# EAGLE board ngff-cardem (EAGLE 7.7.0)
VERSION: v2
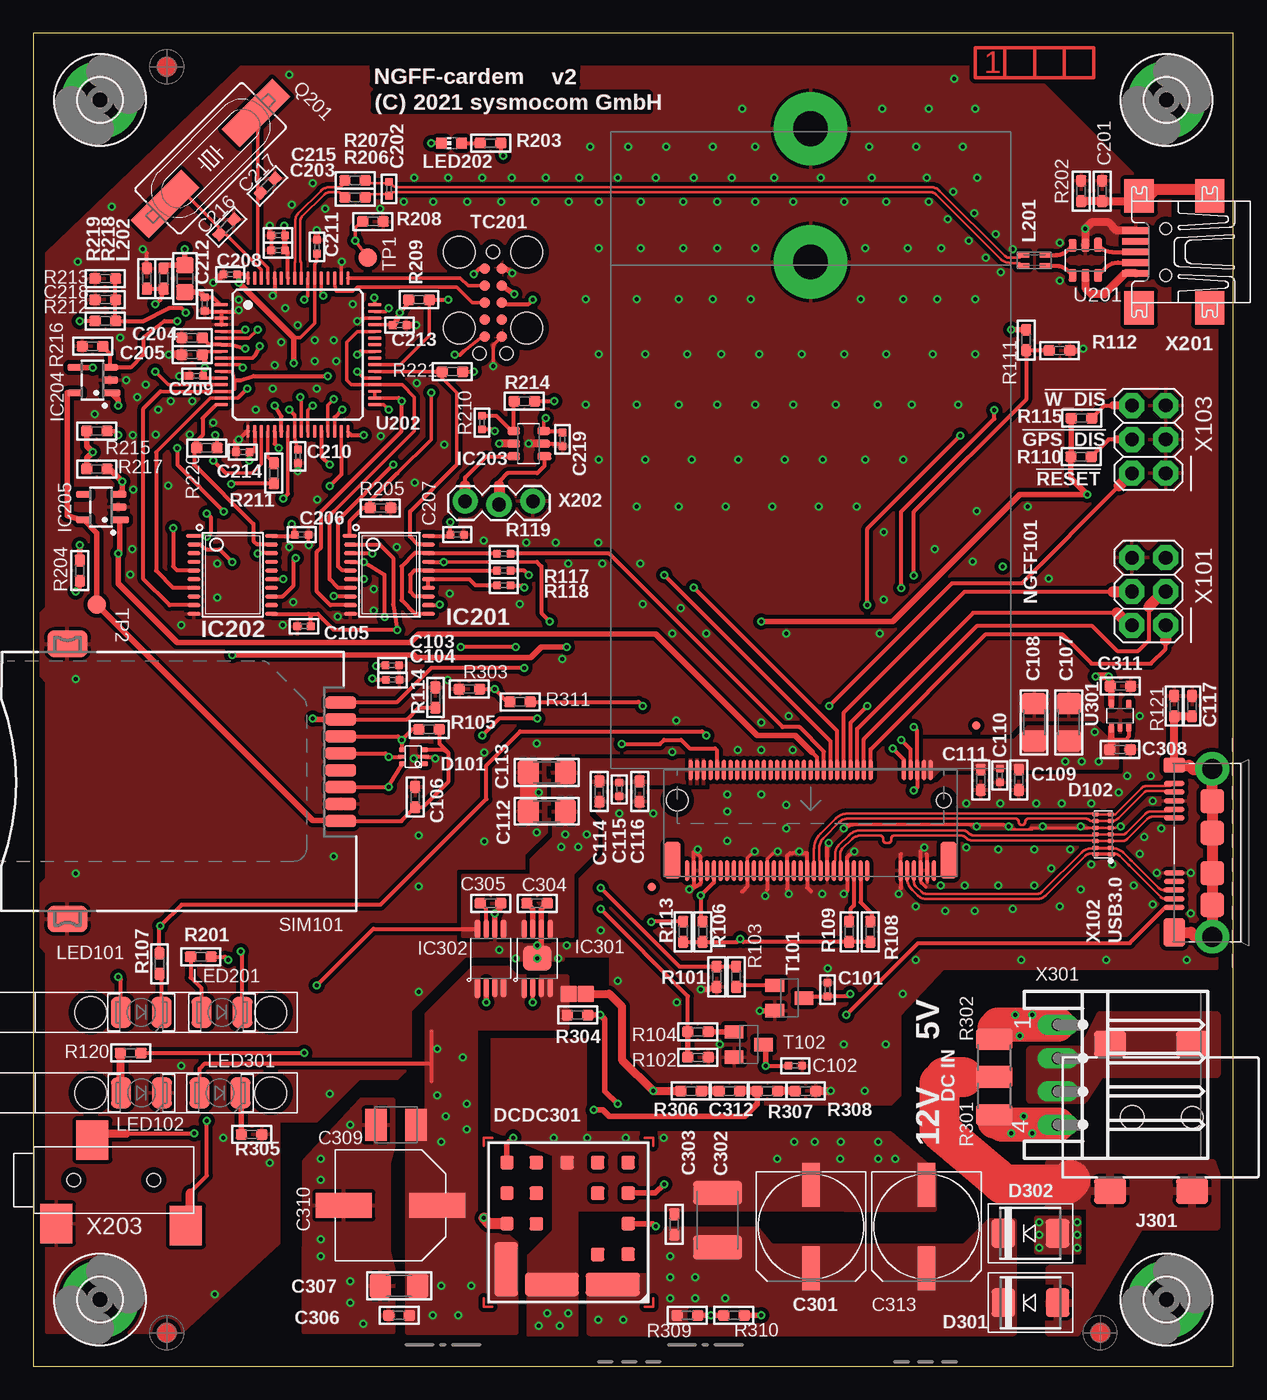
[diagram p3: board, top side]
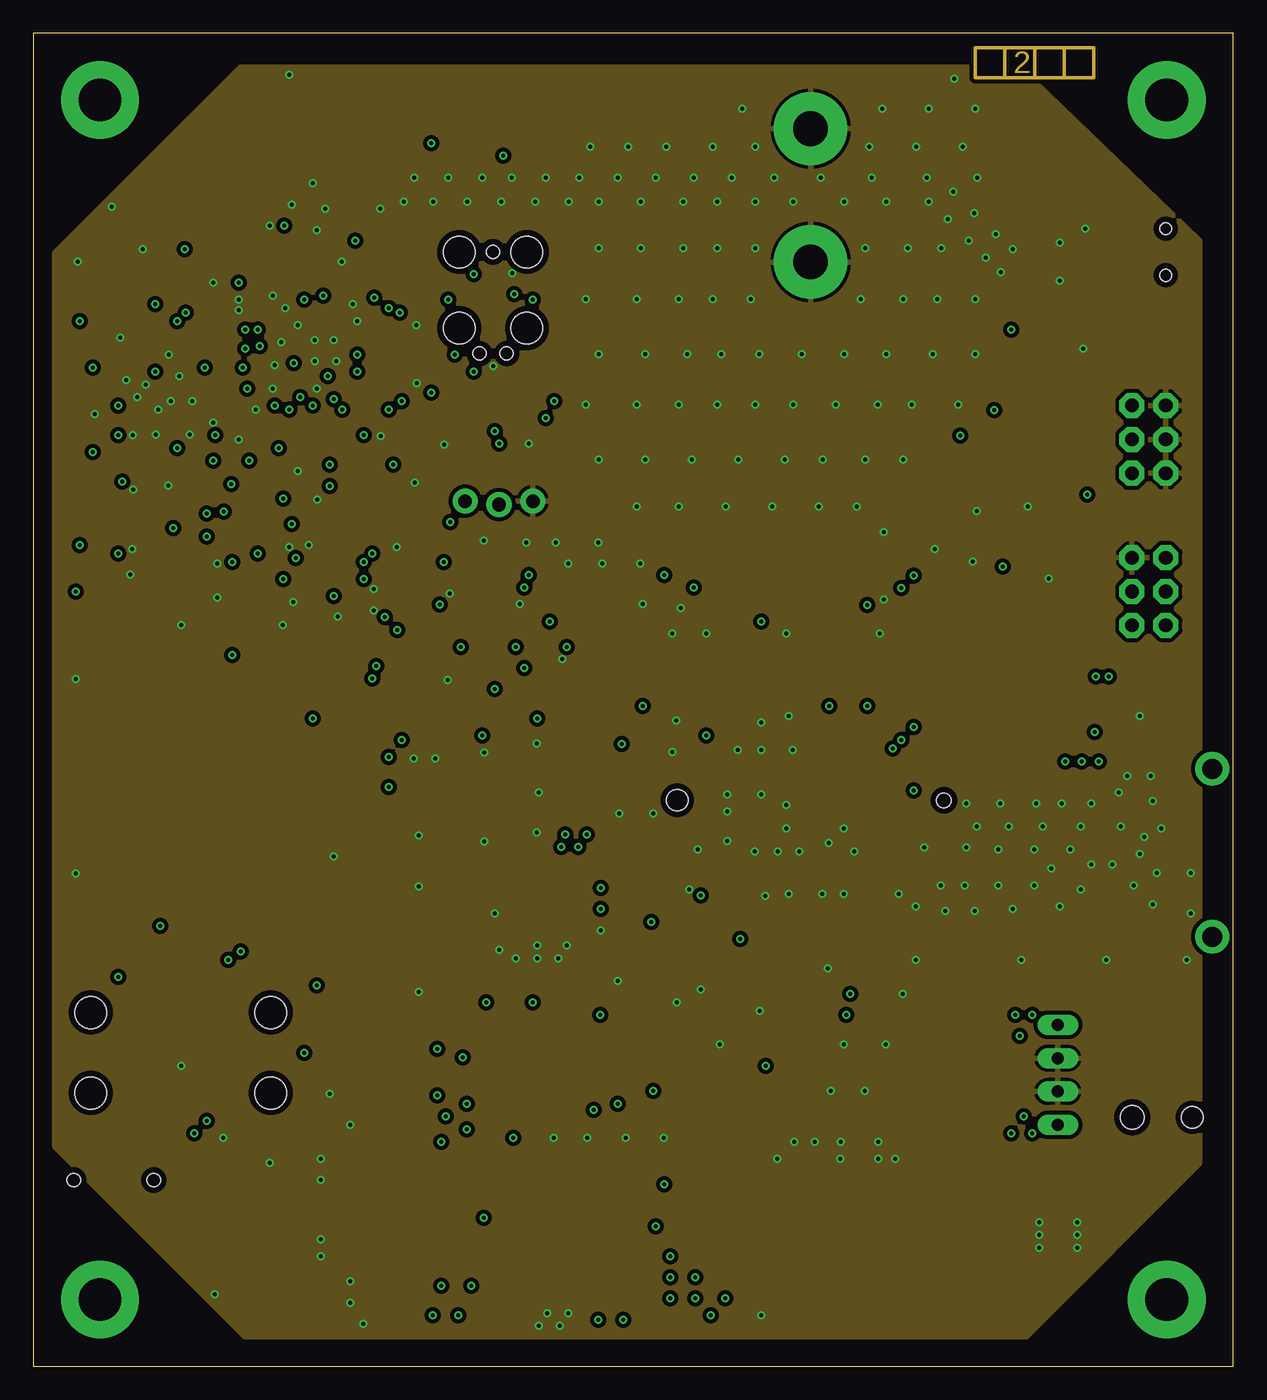
[diagram p4: board, inner layer Route2]
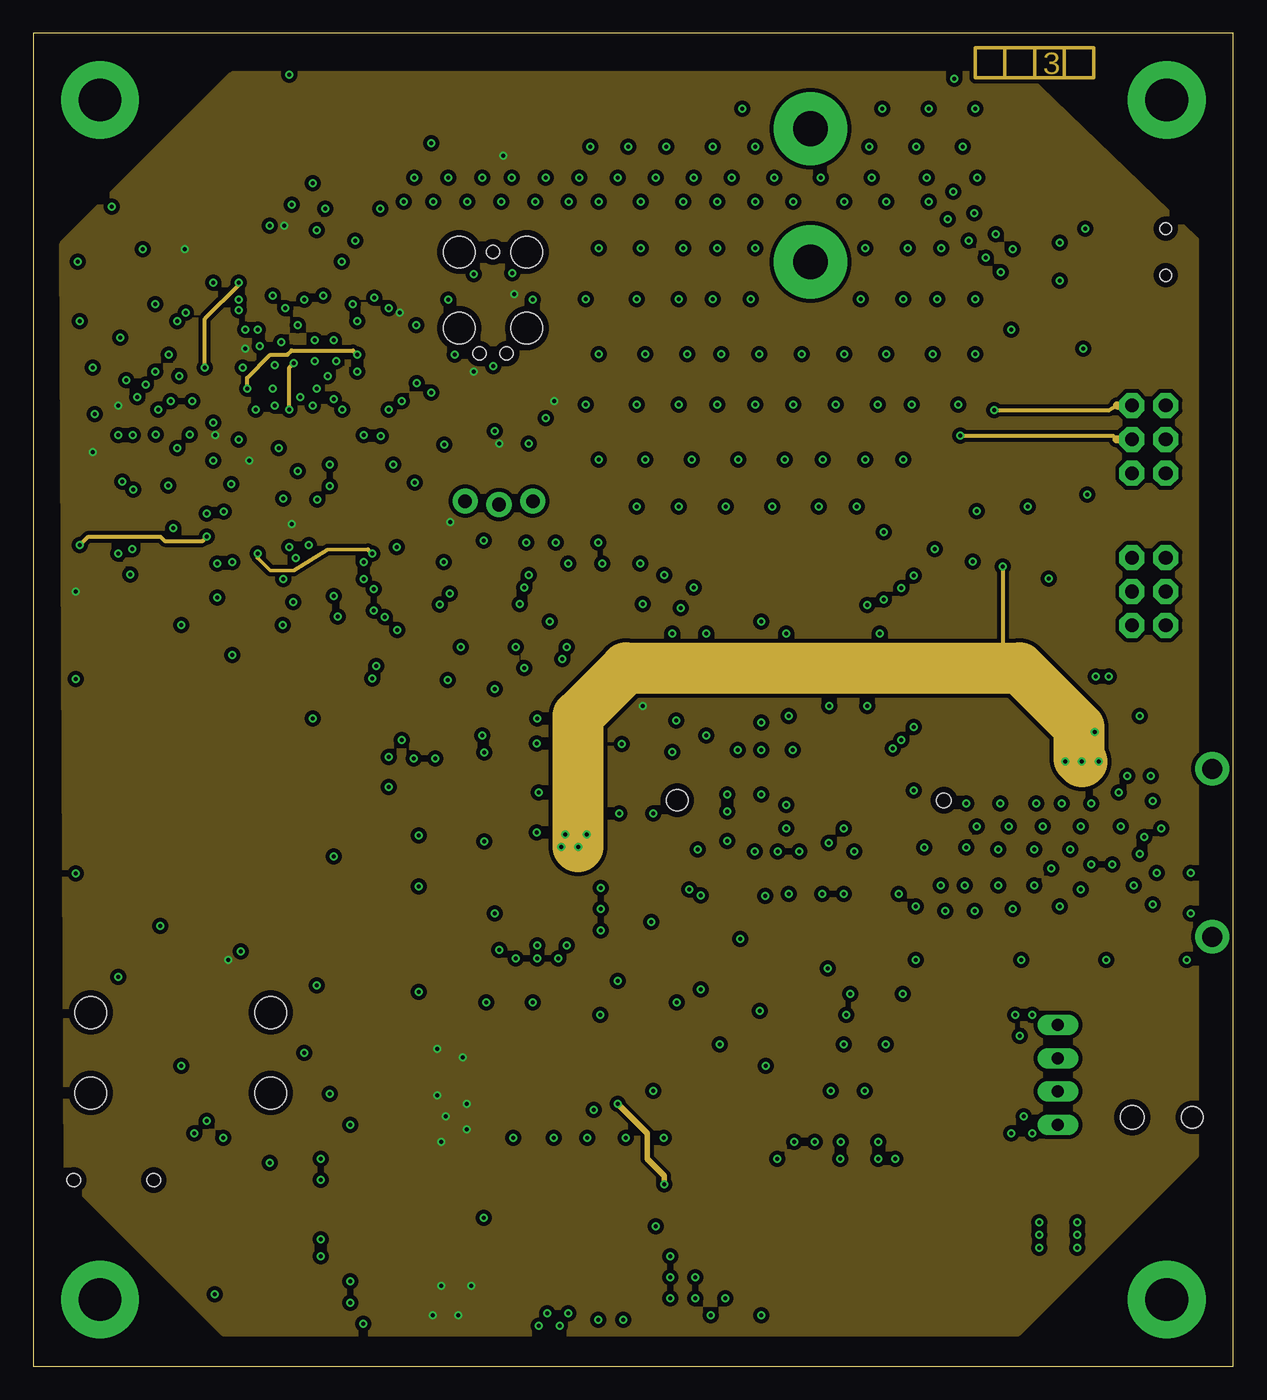
[diagram p5: board, inner layer Route15]
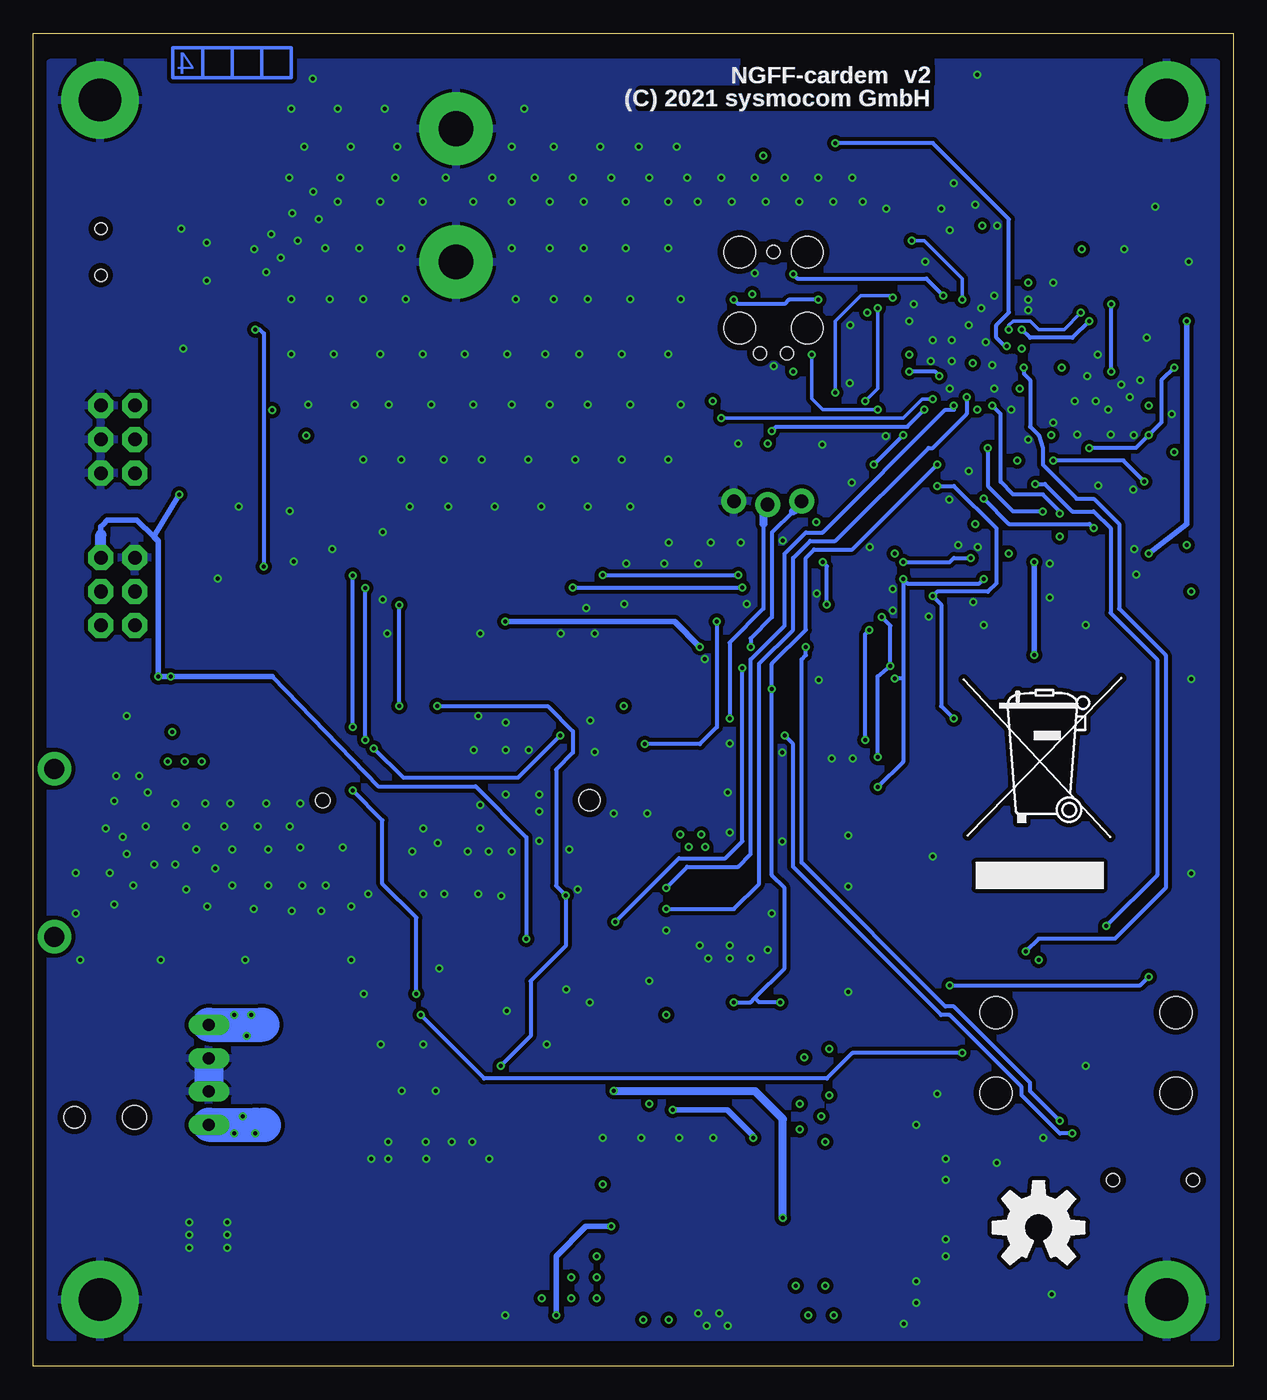
[diagram p6: board, bottom side, seen from below]

Size 90 x 100 mm. Coordinates in mm from the lower left corner, seen from the top.
Outline: 0,100 0,0 90,0 90,100 0,100
Copper layers (1+2*15+16): Top 0.018mm / dielectric 0.12mm / Route2 0.035mm / dielectric 1.2mm / Route15 0.035mm / dielectric 0.12mm / Bottom 0.018mm
Design rules "sysmocom-basista-4layer-prototype *": minimum track width 0.15mm, minimum drill 0.3mm, track to track 0.15mm, track to pad 0.15mm, pad to pad 0.15mm, via to via 0.15mm, smd to smd 0mil, copper to edge 0.45mm, drill to drill 0.25mm, minimum pad ring 0.15mm, minimum via ring 0.15mm, stop-mask expansion 0mil, vias tented up to drill 0mil, thermal gap 10mil
Net classes: 0 default: clearance 0.25 mm; 1 usb: width 0.185 mm, clearance 0.195 mm; 2 supply: width 0.6 mm, clearance 0.3 mm; 3 supply-poly: width 0.6 mm, clearance 0.3 mm to class 0, clearance 0.3 mm

## Footprints (pad centres in the part's own frame; a part is rotated, then mirrored left to right if it is on the bottom)
_0402 = smd 0.6 x 0.6: 1 -0.508,0; 2 0.508,0
_0603 = smd 0.9 x 0.8: 1 -0.762,0; 2 0.762,0
1206 = smd 1.6 x 1.8: 1 -1.4,0; 2 1.4,0
UD-8X10_NICHICON = smd 3.3 x 1.3: + 3.125,0; - -3.125,0
C1812K = smd 1.8 x 3.7: 1 -2.05,0; 2 2.05,0
SMC_B = smd 1.6 x 2.4: + -1.5,0; - 1.5,0
4.2X1.9X2.8(BXCXA) = smd 4.2 x 1.9: 1 3.5,0; 2 -3.5,0
SOT666 = smd 0.375 x 0.5: 1 -0.538,-0.85; 3 0.538,-0.85; 4 0.538,0.85; 6 -0.538,0.85 | smd 0.3 x 0.6: 2 0,-0.9; 5 0,0.9
UDFN-14 = smd 0.3 x 0.6: 1 -1.5,-0.625 | smd 0.3 x 0.5: 2 -1,-0.575; 3 -0.5,-0.575; 4 0,-0.575; 5 0.5,-0.575; 6 1,-0.575; 7 1.5,-0.575; 8 1.5,0.575; 9 1,0.575; 10 0.5,0.575; 11 0,0.575; 12 -0.5,0.575; 13 -1,0.575; 14 -1.5,0.575
SMBDIODE = smd 1.78 x 2.16: A 2.04,0; C -2.03,0
DC-DC_CON-ALLPADS = smd 1.01 x 1.01: 1 -4.48,0.1; 5 4.61,0.1; 6 4.61,-4.48; 7 0.1,-4.48; 8 -2.19,-4.48; 9 -4.48,-4.48; 10 -4.48,-2.19; 11 4.61,-2.19; 12 2.4,-4.48; 13 -2.19,-2.18; 14 2.4,-2.18; 15 -4.48,2.4; 16 -2.19,2.42; 17 2.4,0.12 | smd 4.07 x 1.77: 2 -3.33,4.67; 3 1.24,4.67 | smd 1.77 x 4.07: 4 4.67,3.53
3,2-PAD = drill 3.2 pad 5.842: B3,2 0,0
TSSOP20 = smd 0.3 x 1.1: 1 -2.925,-2.97 | smd 0.3 x 0.991: 2 -2.275,-2.918; 3 -1.625,-2.918; 4 -0.975,-2.918; 5 -0.325,-2.918; 6 0.325,-2.918; 7 0.975,-2.918; 8 1.625,-2.918; 9 2.275,-2.918; 10 2.925,-2.918; 11 2.925,2.918; 12 2.275,2.918; 13 1.625,2.918; 14 0.975,2.918; 15 0.325,2.918; 16 -0.325,2.918; 17 -0.975,2.918; 18 -1.625,2.918; 19 -2.275,2.918; 20 -2.925,2.918
TSOP-6 = smd 0.6 x 1.05: 1 -0.95,-1.175 | smd 0.6 x 0.95: 2 0,-1.125; 3 0.95,-1.125; 4 0.95,1.125; 5 0,1.125; 6 -0.95,1.125
SOT23-5 = smd 0.55 x 1.4: 1 -0.95,-1.4 | smd 0.55 x 1.2: 2 0,-1.3; 3 0.95,-1.3; 4 0.95,1.3; 5 -0.95,1.3
HVSSOP8 = smd 1.5 x 0.4: 1 -2.25,0.975 | smd 1.4 x 0.4: 2 -2.2,0.325; 3 -2.2,-0.325; 4 -2.2,-0.975; 5 2.2,-0.975; 6 2.2,-0.325; 7 2.2,0.325; 8 2.2,0.975 | smd 1.9 x 2.15: EXP 0,0
VSSOP8 = smd 1.5 x 0.4: 1 -2.25,0.975 | smd 1.4 x 0.4: 2 -2.2,0.325; 3 -2.2,-0.325; 4 -2.2,-0.975; 5 2.2,-0.975; 6 2.2,-0.325; 7 2.2,0.325; 8 2.2,0.975
694108106102 = smd 2.4 x 2: 1 11.15,5.5; 1-1 5,5.5; 2 5,-5.5; 3 11.15,-5.5 | hole 1.6: 5,0 | hole 1.8: 9.5,0
MICRO-FIDUCIAL = smd 0.635 x 0.635: 1 0,0
WE-CNSW_0805 = smd 0.4 x 0.9: 1 -0.4,-0.85; 2 -0.4,0.85; 3 0.4,0.85; 4 0.4,-0.85
_0805 = smd 1.2 x 1.3: 1 -1.016,0; 2 1.016,0
PLCC2-MIN = smd 1.5 x 2.3: A -1.524,0; K 1.524,0
CHIP-LED0603 = smd 0.8 x 0.8: A 0,-0.75; C 0,0.75
1270.1001 = hole 2.4: 13.5,0; 0,0
NGFF_3042_3052_NSOL = smd 0.3 x 1.55: 1 -9.25,5.275; 2 -9,-2.275; 3 -8.75,5.275; 4 -8.5,-2.275; 5 -8.25,5.275; 6 -8,-2.275; 7 -7.75,5.275; 8 -7.5,-2.275; 9 -7.25,5.275; 10 -7,-2.275; 11 -6.75,5.275; 20 -4.5,-2.275; 21 -4.25,5.275; 22 -4,-2.275; 23 -3.75,5.275; 24 -3.5,-2.275; 25 -3.25,5.275; 26 -3,-2.275; 27 -2.75,5.275; 28 -2.5,-2.275; 29 -2.25,5.275; 30 -2,-2.275; 31 -1.75,5.275; 32 -1.5,-2.275; 33 -1.25,5.275; 34 -1,-2.275; 35 -0.75,5.275; 36 -0.5,-2.275; 37 -0.25,5.275; 38 0,-2.275; 39 0.25,5.275; 40 0.5,-2.275; 41 0.75,5.275; 42 1,-2.275; 43 1.25,5.275; 44 1.5,-2.275; 45 1.75,5.275; 46 2,-2.275; 47 2.25,5.275; 48 2.5,-2.275; 49 2.75,5.275; 50 3,-2.275; 51 3.25,5.275; 52 3.5,-2.275; 53 3.75,5.275; 54 4,-2.275; 55 4.25,5.275; 56 4.5,-2.275; 57 4.75,5.275; 58 5,-2.275; 59 5.25,5.275; 60 5.5,-2.275; 61 5.75,5.275; 62 6,-2.275; 63 6.25,5.275; 64 6.5,-2.275; 65 6.75,5.275; 66 7,-2.275; 67 7.25,5.275; 68 7.5,-2.275; 69 7.75,5.275; 70 8,-2.275; 71 8.25,5.275; 72 8.5,-2.275; 73 8.75,5.275; 74 9,-2.275; 75 9.25,5.275 | smd 1.2 x 2.75: MNT1 -10.35,4.5; MNT2 10.35,4.5 | drill 2.6 pad 5.5: P$1 0,-40.394; P$2 0,-50.394 | hole 1.1: -10,0 | hole 1.6: 10,0
HC49UP = smd 5.334 x 1.93: 1 -4.826,0; 2 4.826,0
1210 = smd 1.6 x 2.7: 1 -1.4,0; 2 1.4,0
SHORT_TOP-50 = smd 1.27 x 1.27: 1 0.635,0; 2 -0.635,0
MOLEX-475530001 = smd 2.3 x 0.9: C1 -14.47,2.98; C2 -14.47,0.44; C3 -14.47,-2.1; C5 -14.47,1.71; C6 -14.47,-0.83; C7 -14.47,-3.37; CD1 -14.47,-4.64; CD2 -14.47,-5.91 | smd 3 x 2: S1 6.032,10.319; S2 6.032,-10.319
SOT23-BEC = smd 1 x 1.4: B -0.95,-1.1; C 0,1.1; E 0.95,-1.1
TC2050-IDC = smd 0.787 x 0.787: 1 -2.54,-0.635; 2 -2.54,0.635; 3 -1.27,-0.635; 4 -1.27,0.635; 5 0,-0.635; 6 0,0.635; 7 1.27,-0.635; 8 1.27,0.635; 9 2.54,-0.635; 10 2.54,0.635 | hole 0.991: -3.81,0; 3.81,1.016; 3.81,-1.016 | hole 2.375: -3.81,2.54; -3.81,-2.54; 1.905,2.54; 1.905,-2.54
TP14R = smd 1.4 x 1.4: TP 0,0
LQFP64 = smd 0.25 x 1.2: 1 -3.75,-5.85 | smd 0.25 x 1: 2 -3.25,-5.75; 3 -2.75,-5.75; 4 -2.25,-5.75; 5 -1.75,-5.75; 6 -1.25,-5.75; 7 -0.75,-5.75; 8 -0.25,-5.75; 9 0.25,-5.75; 10 0.75,-5.75; 11 1.25,-5.75; 12 1.75,-5.75; 13 2.25,-5.75; 14 2.75,-5.75; 15 3.25,-5.75; 16 3.75,-5.75; 33 3.75,5.75; 34 3.25,5.75; 35 2.75,5.75; 36 2.25,5.75; 37 1.75,5.75; 38 1.25,5.75; 39 0.75,5.75; 40 0.25,5.75; 41 -0.25,5.75; 42 -0.75,5.75; 43 -1.25,5.75; 44 -1.75,5.75; 45 -2.25,5.75; 46 -2.75,5.75; 47 -3.25,5.75; 48 -3.75,5.75 | smd 1 x 0.25: 17 5.75,-3.75; 18 5.75,-3.25; 19 5.75,-2.75; 20 5.75,-2.25; 21 5.75,-1.75; 22 5.75,-1.25; 23 5.75,-0.75; 24 5.75,-0.25; 25 5.75,0.25; 26 5.75,0.75; 27 5.75,1.25; 28 5.75,1.75; 29 5.75,2.25; 30 5.75,2.75; 31 5.75,3.25; 32 5.75,3.75; 49 -5.75,3.75; 50 -5.75,3.25; 51 -5.75,2.75; 52 -5.75,2.25; 53 -5.75,1.75; 54 -5.75,1.25; 55 -5.75,0.75; 56 -5.75,0.25; 57 -5.75,-0.25; 58 -5.75,-0.75; 59 -5.75,-1.25; 60 -5.75,-1.75; 61 -5.75,-2.25; 62 -5.75,-2.75; 63 -5.75,-3.25; 64 -5.75,-3.75
SC70-5 = smd 0.4 x 0.8: 1 -0.65,-0.9 | smd 0.4 x 0.7: 2 0,-0.85; 3 0.65,-0.85; 4 0.65,0.85; 5 -0.65,0.85
2X03 = drill 1.016 pad 1.88 octagon: 1 -2.54,-1.27; 2 -2.54,1.27; 3 0,-1.27; 4 0,1.27; 5 2.54,-1.27; 6 2.54,1.27
ZX360D-B = smd 0.4 x 1.5: 1 -1.3,0; 2 -0.65,0; 3 0,0; 4 0.65,0; 5 1.3,0; 6 5.4,0; 7 6.05,0; 8 6.7,0; 9 7.35,0; 10 8,0 | drill 1.5: S1 -3.5,-2.85; S2 9.1,-2.85 | smd 2.1 x 1.6: S3 -3.175,0 | smd 1.1 x 1.6: S4 9.366,0 | smd 1.8 x 1.8: S5 -1.111,-2.857; S6 1.27,-2.857; S7 4.286,-2.857; S8 6.668,-2.857
UX60-MB-5ST = smd 2 x 0.5: 1 2.25,1.6; 2 2.25,0.8; 3 2.25,0; 4 2.25,-0.8; 5 2.25,-1.6 | smd 2.2 x 2.5: M1 -3.3,-4.2; M2 -3.3,4.2; M3 2,4.2; M4 2,-4.2 | hole 0.9: 0,-1.75; 0,1.75
1X03_LOCK = drill 1.016 pad 1.88: 1 0,0.127; 2 2.54,-0.127; 3 5.08,0.127
JACK2.5_SJ-2523 = smd 2.4 x 2.94: 1 -4.3,-3.274; 2 5.4,-3.424; 3 -1.6,3 | hole 1: -3,0; 3,0
171826-4 = drill 0.9 long: 1 3.75,0; 2 1.25,0; 3 -1.25,0; 4 -3.75,0

## Placement (x,y rotation side)
C101  33p  [_0402]  59.56,28.25 90 top
C102  33p  [_0402]  57.15,22.54 0 top
C103  33p  [_0402]  26.91,52.58 0 top
C104  33p  [_0402]  26.94,51.49 0 top
C105  33p  [_0402]  20.3,55.51 180 top
C106  100n  [_0603]  28.64,42.7 90 top
C107  100u  [1206]  77.66,48.31 270 top
C108  100u  [1206]  75.06,48.31 270 top
C109  100n  [_0603]  73.91,43.99 90 top
C110  33p  [_0402]  72.49,44.31 270 top
C111  10p  [_0603]  71.06,43.99 270 top
C112  100u  [1206]  38.51,41.63 0 top
C113  100u  [1206]  38.51,44.55 0 top
C114  100n  [_0603]  42.45,43.12 90 top
C115  33p  [_0402]  43.94,43.28 270 top
C116  10p  [_0603]  45.47,43.12 270 top
C117  100n  [_0603]  86.9,49.53 270 top
C201  100n  [_0603]  80.17,88.17 270 top
C202  33p  [_0402]  26.67,88.33 90 top
C203  100n  [_0402]  18.35,84.84 0 top
C204  2.2u  [_0603]  11.91,77.15 0 top
C205  2.2u  [_0603]  11.91,75.88 0 top
C206  100n  [_0402]  20.13,62.39 180 top
C207  100n  [_0402]  31.78,62.39 180 top
C208  100n  [_0402]  14.77,81.92 0 top
C209  100n  [_0402]  12.22,74.3 0 top
C210  100n  [_0402]  19.84,68.26 90 top
C211  100n  [_0402]  21.27,83.98 270 top
C212  100n  [_0402]  12.86,79.69 90 top
C213  100n  [_0402]  27.46,78.11 180 top
C214  100n  [_0402]  15.72,68.58 0 top
C215  100n  [_0402]  18.35,83.72 0 top
C216  18p  [_0603]  14.5,85.48 45 top
C217  18p  [_0603]  17.58,88.57 45 top
C218  DNP  [_0603]  5.4,80.01 180 top
C219  33p  [_0402]  39.69,69.53 270 top
C301  220u / 25V  [UD-8X10_NICHICON]  58.33,10.48 270 top
C302  10u / 25V  [C1812K]  51.32,10.96 90 top
C303  100n  [_0603]  48.07,10.64 270 top
C304  1n  [_0603]  37.78,34.73 180 top
C305  1n  [_0603]  34.29,34.73 180 top
C306  100n  [_0603]  27.43,3.81 0 top
C307  22u 10V  [1206]  27.43,6.03 180 top
C308  100n  [_0603]  81.5,46.26 180 top
C309  DNP  [SMC_B]  27.19,18.1 180 top
C310  330u  [4.2X1.9X2.8(BXCXA)]  26.8,12.06 0 top
C311  100n  [_0603]  81.53,51.02 180 top
C312  DNP  [_0603]  52.2,20.64 180 top
C313  DNP  [UD-8X10_NICHICON]  66.99,10.48 270 top
D101  PESD5V0UBV  [SOT666]  28.51,45.72 90 top
D102  SP3012-6UTG  [UDFN-14]  80.23,39.9 90 top
D301  STPS5L60U  [SMBDIODE]  74.78,4.77 0 top
D302  SMBJ13A  [SMBDIODE]  74.78,9.97 0 top
DCDC301  OKL-T/3-W12P-C  [DC-DC_CON-ALLPADS]  40.13,10.8 180 top
FID1  [VISION_REF15]  10,97.5 0 top
FID2  [VISION_REF15]  10,2.5 0 top
FID3  [VISION_REF15]  80,2.5 0 top
H301  MOUNT-PAD-ROUND3.2  [3,2-PAD]  5,95 0 top
H302  MOUNT-PAD-ROUND3.2  [3,2-PAD]  85,95 0 top
H303  MOUNT-PAD-ROUND3.2  [3,2-PAD]  5,5 0 top
H304  MOUNT-PAD-ROUND3.2  [3,2-PAD]  85,5 0 top
IC201  CB3Q3244PW  [TSSOP20]  26.7,59.37 270 top
IC202  CB3Q3244PW  [TSSOP20]  14.96,59.37 270 top
IC203  IP4234CZ6  [TSOP-6]  37.15,69.22 90 top
IC204  FPF2109  [SOT23-5]  4.45,73.98 90 top
IC205  FPF2109  [SOT23-5]  5.08,64.45 90 top
IC301  TPS22958N-DGN  [HVSSOP8]  37.78,30.61 90 top
IC302  TPS22958N-DGK  [VSSOP8]  34.29,30.61 90 top
J301  PJ-002BH-SMT-TR  [694108106102]  91.92,18.67 180 top
JP102  FIDUCIALUFIDUCIAL  [MICRO-FIDUCIAL]  46.39,35.94 180 top
JP103  FIDUCIALUFIDUCIAL  [MICRO-FIDUCIAL]  70.71,48.05 180 top
L201  744231091  [WE-CNSW_0805]  75.09,82.96 270 top
L202  74279220601  [_0805]  11.37,81.6 270 top
LED101  LEDPLCC2-MIN-AMBER  [PLCC2-MIN]  8.1,26.55 0 top
LED102  LEDPLCC2-MIN-green  [PLCC2-MIN]  8.11,20.5 0 top
LED201  LEDPLCC2-MIN-green  [PLCC2-MIN]  14.15,26.55 0 top
LED202  KPH-1608EC  [CHIP-LED0603]  31.35,91.76 90 top
LED301  LEDPLCC2-MIN-green  [PLCC2-MIN]  14,20.5 0 top
LOGO1  OSHW-LOGOL-COPPER  [OSHW-LOGO-L_COPPER]  14.61,10.4 0 bottom
M2  MENTOR_12701001  [1270.1001]  4.3,26.53 0 top
M3  MENTOR_12701001  [1270.1001]  4.3,20.5 0 top
NGFF101  NGFF_B-NSOL  [NGFF_3042_3052_NSOL]  58.29,42.45 180 top
Q201  12MHz  [HC49UP]  13.29,90.62 225 top
R101  10k  [_0603]  51.24,29.21 270 top
R102  10k  [_0603]  49.85,23.18 0 top
R103  4.7k  [_0603]  52.7,29.21 90 top
R104  4.7k  [_0603]  49.85,25.08 180 top
R105  DNP  [_0603]  29.69,47.78 180 top
R106  10k  [_0603]  50.2,32.59 270 top
R107  330  [_0603]  9.46,30.2 90 top
R108  10k  [_0603]  62.77,32.59 270 top
R109  10k  [_0603]  61.18,32.59 270 top
R110  10k  [_0603]  78.58,68.23 180 top
R111  10k  [_0603]  74.45,76.99 270 top
R112  100k  [_0603]  76.96,76.2 180 top
R113  4.7k  [_0603]  48.74,32.59 90 top
R114  47k  [_0603]  30.16,50.16 270 top
R115  10k  [_0603]  78.61,71.12 180 top
R117  47  [_0402]  35.27,59.69 180 top
R118  47  [_0402]  35.27,58.58 180 top
R119  47  [_0402]  35.27,60.96 180 top
R120  510  [_0603]  7.3,23.5 0 top
R121  100k  [_0603]  85.56,49.53 270 top
R201  330  [_0603]  12.56,30.72 0 top
R202  100k  [_0603]  78.58,88.17 90 top
R203  330  [_0603]  34.29,91.76 180 top
R204  10k  [_0603]  3.49,59.69 90 top
R205  10k  [_0603]  26.04,64.39 0 top
R206  27  [_0603]  24.13,87.69 180 top
R207  27  [_0603]  24.13,88.96 180 top
R208  10k  [_0603]  25.46,85.88 180 top
R209  1.5k  [_0603]  28.93,80.01 180 top
R210  47  [_0402]  33.66,70.8 90 top
R211  10k  [_0603]  18.04,66.99 90 top
R212  30k  [_0603]  5.4,78.42 180 top
R213  47k  [_0603]  5.4,81.6 0 top
R214  100k  [_0603]  36.83,72.39 0 top
R215  10k  [_0603]  4.76,70.17 0 top
R216  10k  [_0603]  4.45,76.52 180 top
R217  10k  [_0603]  4.76,67.31 180 top
R218  10k  [_0603]  9.78,81.6 270 top
R219  100k  [_0603]  8.51,81.6 270 top
R220  DNP  [_0603]  13.02,68.9 180 top
R221  DNP  [_0603]  31.43,74.61 180 top
R301  0R  [1210]  72.07,20.27 90 top
R302  DNP  [1210]  72.07,23.13 90 top
R303  DNP  [_0603]  32.7,50.8 0 top
R304  100k  [_0603]  40.83,26.35 0 top
R305  330  [_0603]  16.37,17.39 180 top
R306  DNP  [_0603]  49.34,20.64 0 top
R307  2k  [_0603]  55.05,20.64 0 top
R308  180  [_0603]  57.91,20.64 0 top
R309  DNP  [_0603]  49.05,3.81 0 top
R310  DNP  [_0603]  52.55,3.81 0 top
R311  10k  [_0603]  36.51,49.85 0 top
SH301  SHORT-HT5  [SHORT_TOP-50]  40.8,27.94 180 top
SIM101  MOLEX-475530001  [MOLEX-475530001]  8.59,43.88 180 top
T101  BC850  [SOT23-BEC]  56.7,27.62 270 top
T102  BC850  [SOT23-BEC]  53.66,24.13 270 top
TC201  TC2050-IDC  [TC2050-IDC]  34.48,79.79 270 top
TP1  TPTP14R  [TP14R]  25.08,83.19 0 top
TP2  TPTP14R  [TP14R]  4.76,57.15 0 top
U201  IP4234CZ6  [TSOP-6]  78.9,82.96 180 top
U202  AT91SAM3S-AU  [LQFP64]  19.84,75.88 270 top
U301  MIC5366-1.8YC5  [SC70-5]  81.5,48.8 0 top
U$1  [WEEE_BIN_TOP]  14.92,44.92 0 bottom
U$2  [WEEE_BIN]  14.92,42.38 0 bottom
U$7  [OSHW-LOGO-L]  14.61,10.4 0 bottom
X101  PINHD-2X3-SP  [2X03]  83.66,58.12 90 top
X102  ZX360D-B-10P(30)  [ZX360D-B]  85.57,35.72 90 top
X103  PINHD-2X3-SP  [2X03]  83.66,69.53 90 top
X201  MINI-USB-SHIELD-UX60-MB-5ST  [UX60-MB-5ST]  84.93,83.6 180 top
X202  2.54mm  [1X03_LOCK]  32.38,64.77 0 top
X203  JACK2.5_SJ-2523  [JACK2.5_SJ-2523]  6.03,13.97 0 top
X301  171826-4-RA  [171826-4]  76.83,21.86 90 top

## Tracks (layer width: path | path; a pad name or v marks a point on that pad's centre or on a via)
!ALARM_ST_SIM_VDD  (via drill 0.3)
  Top 0.305: v14.29,64.14 10.79,67.63 v10.79,68.9 | R215.2 6.03,70.17 v6.35,69.85 | U202.21 18.09,69.22 v18.41,68.9
  Top 0.406: IC204.4 v4.44,74.93 v4.45,74.93
  Bottom 0.305: v14.29,64.14 16.51,64.14 18.41,66.04 v18.41,68.9 | v10.79,68.9 7.3,68.9 v6.35,69.85 5.4,70.8 5.4,73.98 v4.45,74.93
!BODY_SAR
  Top 0.305: NGFF101.25 61.54,34.56 61.28,34.29 61.28,33.45 R109.1
!CONNECT_MDM_SIM  (via drill 0.3)
  Top 0.254: U202.48 25.59,80.2 v25.56,80.17 | v29.84,73.03 29.84,69.53 27.3,66.99
  Top 0.305: IC201.1 23.73,63.42 24.7,64.39 R205.1 25.27,64.96 27.3,66.99
  Bottom 0.254: v25.56,80.17 25.72,80.33 26.04,80.33 27.94,80.33 29.84,78.42 v29.84,73.03
!CONNECT_UART1
  Top 0.254: U202.16 13.71,72.13
  Top 0.305: 13.71,72.13 12.7,71.12 12.7,69.85 12.06,69.22 12.06,68.9 | 12.06,68.9 12.06,67.63 16.51,63.18 16.51,61.91 16.77,61.65 IC202.19 | R220.2 12.06,68.9
!CONNECT_UART2
  Top 0.254: 31.75,67.63 31.75,73.03 30.16,74.61 30.14,74.63 U202.38
  Top 0.305: IC201.19 28.84,61.65 28.26,62.23 28.26,64.14 31.75,67.63 | R221.2 30.16,74.61
!GPS_DISABLE  (via drill 0.3)
  Top 0.305: v69.53,69.82 62.55,62.83 v62.55,57.1 | NGFF101.26 61.29,48.28 v62.55,49.53 | 81.28,69.53 80.65,69.53 R110.1
  Top 0.61: 81.28,69.53 82.23,69.53 82.38,69.53 X103.4
  Route15 0.305: v69.53,69.82 80.96,69.82 81.23,69.55
  Route15 0.61: 81.23,69.55 82.39,69.55 X103.4
  Bottom 0.305: v62.55,49.53 v62.55,57.1
!MDM_UIM_RST
  Top 0.305: R118.2 33.18,58.58 32.71,59.05 IC201.15 IC201.14
!NGFF_RESET  (via drill 0.3)
  Top 0.305: NGFF101.67 51.04,36.28 v50.07,35.31 50.07,33.48 R106.1 | v54.93,22.54 C102.1 | v59.69,49.53 68.9,58.74 74.12,58.74 81.42,66.04
  Top 0.406: 56.71,22.61 C102.1 | v54.93,22.54 54.93,23.96 T102.C
  Top 0.813: X103.2 82.38,66.99 81.42,66.04
  Bottom 0.305: v54.93,22.54 52.7,24.77 52.7,28.89 50.07,31.53 v50.07,35.31 50.8,36.04 50.8,44.77 49.53,46.04 49.53,47.62 51.44,49.53 v59.69,49.53
!PWR_ON  (via drill 0.3)
  Top 0.254: U202.26 20.59,71.71 v20.95,72.07
  Top 0.305: v42.55,35.88 48.45,29.98 R101.1 R103.2
  Bottom 0.305: v42.55,35.88 40.96,37.47 37.15,37.47 36.2,38.42 36.2,53.02 33.66,55.56 33.66,60.96 32.07,62.55 30.8,62.55 21.59,71.75 20.95,71.75 v20.95,72.07
!SET_SIM_DET  (via drill 0.3)
  Top 0.305: v13.02,62.23 12.95,62.3 | 12.95,62.3 IC202.1 | 12.95,62.3 13.09,62.3 13.34,62.55 13.34,63.66 v13.02,63.98 | U202.22 18.59,71.26 v18.1,72.07
  Top 0.406: R204.2 v3.49,61.59
  Route15 0.305: v3.49,61.59 4.13,62.23 9.53,62.23 9.84,61.91 12.7,61.91 v13.02,62.23
  Bottom 0.305: v13.02,63.98 13.02,64.14 14.29,65.41 16.51,65.41 17.46,66.36 17.46,71.44 v18.1,72.07
!SIMTRACE_RESET  (via drill 0.3)
  Top 0.254: U202.39 27.51,75.13 29.69,77.31 R209.1
  Top 0.305: R209.1 v31.11,80.01 | v37.47,80.01 37.15,79.69 35.21,79.69 TC201.6
  Bottom 0.305: v31.11,80.01 33.34,80.01 33.66,79.69 37.15,79.69 v37.47,80.01
!SLOT_RST  (via drill 0.3)
  Top 0.305: SIM101.C2 v26.67,43.44 26.67,43.56 D101.6 | IC201.6 24.76,59.05 v24.77,59.05 | C104.1 25.66,51.49 v25.4,51.59 | IC202.15 v18.73,59.05
  Bottom 0.305: 24.77,51.59 v24.77,59.05 24.45,58.74 19.05,58.74 v18.73,59.05 | 24.77,51.59 v25.4,51.59 | 24.77,51.59 24.77,45.34 v26.67,43.44
!ST_UART1_RST  (via drill 0.3)
  Top 0.254: U202.23 19.09,65.45
  Top 0.305: IC202.5 10.79,59.7 10.48,60.01 v10.48,62.87 | 19.09,65.45 v18.73,65.09
  Bottom 0.305: v18.73,65.09 16.83,63.18 10.79,63.18 v10.48,62.87
!ST_UART2_RST  (via drill 0.3)
  Top 0.254: U202.32 23.88,69.85
  Top 0.305: IC201.5 23.17,59.7 22.86,60.01 22.86,63.5 v26.99,67.63 | 23.88,69.85 v24.77,69.85
  Bottom 0.305: v26.99,67.63 v24.77,69.85
!W_DISABLE  (via drill 0.3)
  Top 0.305: v72.07,71.72 72.07,71.09 65.09,64.1 v65.09,58.37 | NGFF101.8 65.79,46.28 v65.09,46.99 | R115.1 80.33,72.07 80.96,72.07 81.6,72.07
  Top 0.61: X103.6 80.96,72.07
  Route15 0.305: v72.07,71.72 80.68,71.72 81.28,72.07
  Route15 0.61: 81.28,72.07 X103.6
  Bottom 0.305: v65.09,46.99 v65.09,58.37
!WAKE_ON_WWAN
  Top 0.305: NGFF101.23 62.04,34.79 62.87,33.97 62.87,33.45 R108.1
+VIN
  Top 0.406: R302.1 R301.2
  Top 0.61: R301.2 69.72,21.67
  Top 2.54: 68.39,21.67 67.94,21.23
  Top 3: 69.72,21.67 68.39,21.67 | 67.94,21.23 67.94,17.73 72.07,14.24 72.12,14.24 72.71,13.65 77.47,13.65 77.79,13.97
  pour Top: 76.17,15.19 76.17,12.06 79.22,12.06 79.22,7.3 76.2,7.3 76.17,2.54 78.27,2.54 83.03,10.48 88.74,10.48 88.74,14.29 88.42,15.24
+VIN_PROT  (via drill 0.3)
  other vias: 51.88,5.08 49.66,5.08 49.66,6.67 47.75,6.67 47.75,5.08 42.35,3.5 44.26,3.5 47.75,8.26
  pour Top (no thermals): 46.48,10.16 46.48,7.11 46.04,6.67 41.75,6.67 41.75,2.54 73.51,2.54 73.51,10.8 71.76,10.8 69.85,8.89 55.33,8.89 54.29,10.16 48.27,10.16 46.99,10.16
_!USIM1_RESET  (via drill 0.3)
  Top 0.305: NGFF101.30 60.29,47.66 v49.53,58.42 | R118.1 36.67,58.58 v36.83,58.42
  Bottom 0.305: v49.53,58.42 v36.83,58.42
_NGFF_USB_D_N
  Top 0.185: 84.87,35.07 arc-45 84.54,35.21 82.18,37.57 82.11,37.64 81.46,38.28 arc45 81.03,38.46 80.96,38.46 | NGFF101.9 65.54,36.62 arc45 65.91,35.74 66.32,35.33 arc45 66.99,35.05 75.27,35.05 arc45 75.94,35.33 78.89,38.28 arc-45 79.32,38.46 80.96,38.46 | D102.14 80.81,38.4 arc45 80.96,38.46
  Top 0.305: X102.2 84.87,35.07
_NGFF_USB_D_P
  Top 0.185: 84.83,35.72 arc-45 84.37,35.91 82.37,37.92 82.29,38 82.26,38.02 81.73,38.55 arc45 81.03,38.84 80.96,38.84 | NGFF101.7 66.04,36.33 arc45 66.17,36.01 66.58,35.6 arc45 66.99,35.43 75.27,35.43 arc45 75.67,35.6 78.63,38.55 arc-45 79.32,38.84 80.96,38.84 | D102.13 80.83,38.9 arc-45 80.96,38.84
  Top 0.305: X102.3 84.83,35.72
_SIMTRACE12_USB_D_N
  Top 0.185: 20.09,82.64 20.09,82.72 arc45 20.03,82.87 20.03,85.98 arc-45 20.14,86.23 21.82,87.91 arc-45 22.23,88.08 22.86,88.08 arc-45 23.07,87.99 R206.2
  Top 0.2: U202.56 20.09,82.64
_SIMTRACE12_USB_D_P
  Top 0.185: 19.59,82.62 19.59,82.73 arc-45 19.65,82.87 19.65,85.98 arc-45 19.87,86.49 21.55,88.17 arc-45 22.23,88.45 22.87,88.45 arc45 23.18,88.58 arc-45 23.31,88.91 R207.2
  Top 0.2: U202.57 19.59,82.62
  Top 0.5: 23.24,88.83 arc90 R207.2
_USB_D_N1
  Top 0.305: U201.6 80.44,82.43 arc-45 81.34,82.8 X201.2
_USB_D_P1
  Top 0.15: U201.1 80.02,83.97
  Top 0.305: 80.02,83.97 arc45 80.92,83.6 X201.3
_USIM1_CLK  (via drill 0.3)
  Top 0.305: NGFF101.32 59.79,46.89 v47.31,59.37 | v37.15,59.37 36.83,59.69 R117.1
  Bottom 0.305: v47.31,59.37 v37.15,59.37
_USIM1_DATA
  Top 0.305: NGFF101.34 59.29,46.12 57.47,47.94 56.2,47.94 43.18,60.96 R119.1
EN_MDM_SIM_VDD  (via drill 0.3)
  Top 0.254: U202.19 17.09,67.68 16.41,66.99 14.45,66.99
  Top 0.305: v13.49,67.94 14.45,66.99
  Top 0.406: R217.1 5.71,67.31 v6.67,66.36 6.67,65.69 IC205.3
  Bottom 0.305: v6.67,66.36 8.26,67.94 v13.49,67.94
EN_ST_SIM_VDD  (via drill 0.3)
  Top 0.254: U202.5 15.72,77.63 v15.88,77.79
  Top 0.305: v10.79,78.42 9.84,78.42 8.26,77.15 8.26,75.88 7.3,74.93 6.35,74.93 IC204.3 5.75,75.98 R216.1
  Bottom 0.305: v10.79,78.42 12.06,77.15 15.24,77.15 v15.88,77.79
ERASE  (via drill 0.3)
  Top 0.254: U202.55 20.59,80.28 v20.32,80.01 | R208.2 24.61,85.88 24.13,85.41 v24.13,84.45 TP1.TP
  Bottom 0.254: v20.32,80.01 20.32,81.6 23.18,84.45 v24.13,84.45
GND  (via drill 0.3)
  Top 0.185: 80.96,40.4 81.09,40.4 arc45 81.54,40.58 | 75.17,40.4 74.95,40.4 arc45 74.77,40.32 | 73.03,40.48 73.23,40.28 74.93,40.28 arc-45 74.93,40.32
  Top 0.2: 75.17,40.4 D102.10 80.96,40.4
  Top 0.254: 24.71,78.63 U202.46 | TC201.10 34.48,76.61 v34.48,75.03 | U202.50 23.09,82.85 v23.11,82.87 | 56.74,35.31 56.58,35.62 | NGFF101.51 55.04,38.06 55.47,38.48 | NGFF101.57 53.54,38.15 53.88,38.48 | C206.1 v20.64,61.6 v20.64,61.59 | NGFF101.5 66.54,36.43 arc45 66.62,36.25 66.92,35.95 | NGFF101.3 67.04,36.32 | v60.77,40.36 60.87,40.45 arc-45 61.32,40.64 72.64,40.64 arc-45 73.03,40.48
  Top 0.305: U202.60 18.09,80.48 v17.94,80.33 | U202.2 15.32,79.13 v15.4,79.22 | v24.29,78.42 24.71,78.63 | C212.1 13.23,79.13 U202.2 | U202.2 U202.3 U202.4 | TC201.2 35.12,82.49 | IC203.2 39.5,69.22 C219.2 | C215.1 C203.1 arc-90 17.72,84.96 v17.72,85.57 | U202.17 16,70.13 v15.4,69.53 | R219.1 8.51,83.5 v8.19,83.82 | NGFF101.57 53.54,35.99 53.15,35.59 | NGFF101.51 55.04,35.74 | 58.33,35.62 58.04,35.91 NGFF101.39 58.04,38.45 58.01,38.48 57.25,38.48 v57.44,38.61 56.74,38.48 56.54,38.29 NGFF101.45 56.54,35.82 56.58,35.62 | NGFF101.33 59.54,38.65 arc-45 v59.66,39.25 | NGFF101.3 67.04,38.37 66.99,38.42 | NGFF101.5 66.54,38.6 66.67,38.73 | 60.96,35.56 61.04,35.64 NGFF101.27 61.04,38.18 61.28,38.42 | v30.13,45.6 30.01,45.72 D101.2 28.57,45.72 | v60.77,40.36 arc-45 61.45,40.64 | 65.09,38.42 65.04,38.37 NGFF101.11 65.04,35.92 65.09,35.88 | NGFF101.71 50.04,38.19 49.75,38.48 49.75,38.8 49.54,38.59 NGFF101.73 49.54,36.05 49.12,35.62 50.04,36.23 NGFF101.71
  Top 0.406: TC201.2 35.43,82.33 v35.91,82.01 | T101.E v54.48,26.67 v54.48,26.66 | R101.2 50.67,28.25 v50.04,28.25 | R112.1 78.08,76.14 v78.74,76.33 | IC301.EXP 38.11,31.25 IC301.6 38.11,34.3 C304.1 | IC302.6 v34.62,33.97 v34.61,33.97 35.05,34.42 C305.1 | R310.2 v54.61,3.81
  Top 0.5: C208.1 v13.49,81.28 | C210.1 v19.84,67.15 | v15.4,69.53 15.21,69.41 C214.1 | C213.1 v28.73,78.11 | C211.1 v21.27,85.25
  Top 0.6: R308.2 v59.82,20.64 | X201.5 81.27,85.2 80.64,85.82 79.38,85.82 v78.9,85.34 U201.2
  Top 0.61: C205.1 v10.16,75.88 | C209.1 v10.96,74.3 | IC203.2 v37.15,69.22
  Top 1.27: C113.1 C112.1
  Bottom 0.305: X301.2 76.83,22.54
  Bottom 0.406: 76.83,21.27 76.83,20.64
  Bottom 2.184: 76.83,22.54 76.83,21.27
  other vias: 21.27,73.34 17.94,73.34 16.67,71.75 11.91,72.39 13.49,70.8 9.37,71.75 10.32,72.39 22.7,75.41 22.54,76.99 18.1,75.09 21.11,75.41 23.97,79.69 19.84,78.11 18.89,79.38 21.11,76.99 18.57,76.83 15.4,80.01 38.55,3.97 40.13,3.97 39.5,3.02 37.91,3.02 47.28,17.15 44.42,17.15 41.56,17.15 39.02,17.15 49.18,35.75 49.82,38.77 56.64,35.44 54.1,38.61 55.85,38.61 56.48,42.1 54.9,35.28 60.56,16.83 58.61,16.83 60.52,15.56 57.07,16.83 55.8,15.56 24.73,3.18 21.56,15.56 21.56,9.53 23.78,6.36 23.78,18.1 21.56,13.97 68.07,36.07 75.08,36.07 66.8,38.93 59.18,35.44 60.77,35.44 61.56,38.61 59.56,29.84 56.96,46.23 54.58,46.23 83,48.77 37.75,40.04 37.75,46.71 28.54,45.6 18.7,55.6 19.5,57.34 22.83,56.23 28.77,73.75 30.83,69.15 37.78,30.61 39.37,30.61 37.78,31.56 36.2,30.61 69.98,38.93 21.91,86.84 26.04,86.84 83.31,39.69 84.58,40.33 84.27,36.99 86.81,36.99 83,38.42 81.41,43.03 83.95,42.39 83.79,44.3 82.04,44.3 79.34,42.23 77.12,42.23 75.22,42.23 72.52,42.23 69.98,42.23 64.9,35.44 66.17,34.48 68.39,34.17 70.61,34.17 73.47,34.32 76.96,34.48 78.55,35.75 76.35,37.34 79.34,37.66 80.93,37.66 82.52,36.07 83.95,34.64 86.81,33.98 31.08,51.47 19.37,87.15 20.96,88.74 28.58,89.16 31.12,89.16 33.66,89.16 35.88,89.16 38.42,89.16 40.96,89.16 43.82,89.16 46.67,89.16 49.53,89.16 52.39,89.16 55.56,89.16 59.06,89.16 66.99,89.16 27.78,87.37 30,87.37 32.55,87.37 35.09,87.37 37.62,87.37 40.16,87.37 42.39,87.37 45.56,87.37 48.74,87.37 51.28,87.37 54.13,87.37 56.99,87.37 60.8,87.37 67.15,87.37 68.58,86.04 70.17,84.45 71.44,83.19 69,88.11 70.59,86.52 72.17,84.93 73.44,83.82 63.98,87.37 72.55,82.07 77,81.44 77,84.3 11.08,55.6 10.13,66.07 11.72,69.88 9.18,69.88 8.41,73.66 7.78,72.71 7.51,65.78 6.99,73.98 4.61,71.44 6.51,77.15 3.33,82.87 5.88,87 7.27,59.41 7.46,69.85 7.43,61.31 54.58,48.29 47.91,54.96 45.69,57.18 42.67,60.2 45.53,60.2 42.35,61.79 39.18,61.79 40.13,60.2 36.96,61.79 33.78,61.95 65.22,27.95 60.77,24.14 66.17,30.48 74.11,30.48 80.45,30.48 86.49,30.48 51.5,24.13 43.81,28.89 48.26,27.3 47.91,46.07 48.23,48.45 37.91,43.06 43.94,41.47 46.48,41.47 52.83,46.23 39.66,53.06 36.48,57.18 14.26,17.15 11.08,22.55 31.24,57.98 27.27,61.47 19.18,61.47 13.78,60.2 13.78,57.66 25.53,56.71 25.53,58.3 17.75,15.24 13.62,5.4 63.37,16.83 64.64,15.56 63.37,15.56 62.87,89.16 45.56,83.88 48.74,83.88 51.28,83.88 54.13,83.88 62.39,83.88 65.56,83.88 68.11,83.88 45.24,80.07 48.42,80.07 50.96,80.07 53.82,80.07 62.07,80.07 65.25,80.07 67.79,80.07 70.64,80.07 45.88,75.94 49.05,75.94 51.59,75.94 54.45,75.94 57.63,75.94 60.8,75.94 63.98,75.94 67.47,75.94 70.64,75.94 45.24,72.13 48.42,72.13 51.28,72.13 54.13,72.13 56.99,72.13 60.17,72.13 63.34,72.13 65.88,72.13 69.38,72.13 45.88,68 49.37,68 52.87,68 56.36,68 59.22,68 62.39,68 65.25,68 45.24,64.51 48.42,64.51 51.91,64.51 55.41,64.51 58.9,64.51 61.76,64.51 42.39,83.88 41.44,80.07 42.39,75.94 41.44,72.13 42.39,68 52.04,42.9 54.58,42.9 52.04,41.63 52.04,39.4 56.48,40.36 69.06,96.58 19.21,96.9 54.13,91.5 62.71,91.5 66.2,91.5 67.15,94.36 63.66,94.36 53.18,94.36 50.96,91.5 47.47,91.5 44.61,91.5 41.75,91.5 69.69,91.5 70.64,94.36 70.8,89.16 70.77,40.49 73.15,40.49 75.69,40.49 78.55,40.49 81.57,40.49 77.78,38.77 75.08,38.77 72.38,38.77 69.84,36.07 72.38,36.07 62.36,20.64 63.95,24.14 42.55,32.7 33.81,39.37 33.81,46.04 26.07,69.79 28.61,66.29 21.3,65.02 21.56,8.26 23.78,4.77 40.01,31.56 34.92,31.24 22.54,38.23 3.17,36.96 3.17,51.56 28.89,39.81 22.23,20.45 28.89,28.07 28.89,36.01 48.55,56.87 50.45,54.96 56.64,48.77 56.48,54.96 63.47,54.96 67.6,61.31 70.77,64.17 74.58,64.49 70.45,60.36 76.17,59.09 63.79,62.58 63.79,57.5 75.44,10.8 75.44,9.85 75.44,8.89 78.3,10.8 78.3,9.85 78.3,8.89
  pour Top (isolate 0.305, no thermals): 59.22,11.75 60.8,11.75 67.63,11.75 67.63,14.61 64.3,17.47 41.4,17.46 41.4,24.45 34.42,24.45 34.42,17.78 39.02,15.88 39.02,10.13 37.15,8.26 37.12,2.39 40.77,2.39 40.77,11.75
  pour Top: 42.45,42.77 45.62,42.77 45.62,41.18 42.77,41.18
  pour Top (no thermals): 74.77,23.77 78.74,23.77 80.01,26.35 88.74,26.35 88.74,21.91 80.01,21.91 78.74,19.95 74.77,19.95
  pour Top: 24.57,20 26.99,20 26.99,16.51 26.67,15.24 26.67,8.57 26.99,7.3 26.99,2.54 20.29,2.54 20.32,15.4
  pour Route2: 1.59,83.5 15.56,97.47 73.98,97.47 87.47,84.45 87.47,15.24 74.45,2.22 15.88,2.22 1.59,16.51
  pour Top (rank 6): 1,2.54 1,83.5 15.56,97.47 74.45,97.47 83.34,88.58 88.74,88.58 88.74,29.84 68.23,29.84 64.99,26.35 64.99,20.32 64.36,19.68 47.12,19.68 43.31,23.5 43.31,30.8 32.38,30.8 28.26,26.67 28.26,22.54 27.3,21.59 24.45,21.59 21.27,18.41 18.41,18.41 18.41,9.21 11.11,2.54
  pour Bottom: 1.27,97.79 88.74,97.79 88.74,2.22 1.27,2.22
  pour Top: 0.32,56.2 0.32,52.07 1.27,51.12 5.08,51.12 5.08,57.15 1.27,57.15
  pour Top: 0.32,35.88 0.32,31.75 1.27,30.8 5.08,30.8 5.08,36.83 1.27,36.83
  pour Top (rank 6, no thermals): 35.88,31.59 39.69,31.59 39.69,30.48 35.88,30.48
  pour Top (no thermals): 75.25,11.11 78.42,11.11 78.42,8.57 75.25,8.57
MDM_SIM_DET  (via drill 0.3)
  Top 0.254: v30.8,60.35 37.76,60.35
  Top 0.305: IC201.17 v30.8,60.35 | 37.76,60.35 38.1,60.01 38.1,56.52 v38.73,55.88 | v44.13,46.67 46.99,46.67 47.31,46.99 48.58,46.99 49.21,46.35 51.12,46.35 51.29,46.18 NGFF101.66 | IC201.12 30.43,57.1 v30.48,57.15
  Bottom 0.305: v38.73,55.88 38.73,47.94 40.01,46.67 v44.13,46.67 | v30.48,57.15 30.48,60.03 v30.8,60.35
MDM_UIM_CLK
  Top 0.305: IC201.13 28.61,57.75 28.26,58.1 28.26,59.37 28.58,59.7 IC201.16 R117.2
MDM_UIM_IO
  Top 0.305: IC201.11 28.64,56.45 27.62,57.47 27.62,60.01 28.61,61 IC201.18 29.66,60.96 R119.2
MDM_UIM_VDD  (via drill 0.3)
  Top 0.305: NGFF101.36 58.79,45.66 58.42,46.04 | R212.2 v3.49,78.42
  Top 0.406: 58.42,46.04 57.15,47.31 54.29,47.31 46.67,54.93 28.89,54.93 28.26,54.29 10.79,54.29 6.35,58.74 v6.35,60.96 6.48,61.09 IC205.1
  Bottom 0.406: v3.49,78.42 3.49,63.18 v6.35,60.96
MODEM_EN  (via drill 0.3)
  Top 0.305: U202.28 21.59,68.26 v22.23,67.63 | v37.47,27.3 IC301.2 | R303.2 v34.61,50.8 35.56,49.85 R311.1
  Top 0.406: IC302.2 33.97,27.31 v33.97,27.3
  Bottom 0.305: v37.47,27.3 36.2,27.3 35.88,27.62 | 35.88,27.62 33.66,29.84 33.66,35.88 34.61,36.83 v34.61,50.8 34.61,52.7 32.07,55.24 32.07,60.64 31.43,61.28 28.57,61.28 v22.23,67.63 | v33.97,27.3 35.56,27.3 35.88,27.62
N$1
  Top 0.305: L201.2 76.7,83.36 arc45 77.6,83.73 U201.3
N$2
  Top 0.305: L201.3 76.7,82.56 arc-45 77.6,82.19 U201.4
N$3  (via drill 0.3)
  Top 0.305: SIM101.CD2 23.12,49.85 27.3,49.85 29.84,52.39 v36.83,52.39 | R113.2 46.37,33.35 v46.35,33.34
  Bottom 0.305: v46.35,33.34 41.59,38.1 38.1,38.1 36.83,39.37 v36.83,52.39
N$4
  Top 0.305: LED202.A R203.2
N$5  (via drill 0.3)
  Top 0.305: IC202.18 16.86,61 v16.83,60.96 | IC201.3 25.05,61 v25.4,60.96
  Route15 0.254: 16.83,60.64 17.78,59.69 19.53,59.69 22.07,61.28 25.08,61.28
  Route15 0.305: v16.83,60.96 16.83,60.64 | 25.08,61.28 v25.4,60.96
N$6
  Top 0.6: C312.2 R306.2
N$7
  Top 0.406: R305.2 15.61,20.42 LED301.K
N$8  (via drill 0.3)
  Top 0.254: U202.30 22.59,71.17
  Top 0.305: R210.1 34.48,70.29 v34.61,70.17 | 22.59,71.17 v23.18,71.75
  Bottom 0.305: v34.61,70.17 34.29,70.48 24.45,70.48 v23.18,71.75
N$9
  Top 0.254: X201.M1 88.1,87.8 87.95,87.95
  Top 0.6: C201.2 R202.1
  Top 0.61: C201.2 82.54,87.41 X201.M4
  Top 0.813: 88.23,87.66 87.95,87.95 87.63,88.27 83.4,88.27 X201.M4 83.67,87.8 84.14,88.27
N$10
  Top 0.6: X102.S4 R121.2 C117.2
  Top 0.61: 88.36,44.77 X102.S2 | 88.36,42.45 X102.S8 | X102.S1
  Top 0.813: X102.S4 86.68,45.09 87,44.77 88.36,44.77 88.36,42.45 | X102.S8 X102.S7 X102.S6 X102.S5 X102.S1 | X102.S3 86.83,32.55 87.16,32.22 X102.S1
N$11
  Top 0.406: R104.1 T102.B
N$12
  Top 0.305: R201.1 11.8,29.16 12.62,28.34 LED201.A
N$13  (via drill 0.3)
  Top 0.406: R304.2 42.23,26.36 v42.51,26.36 42.86,26.01 42.86,20.64 v43.81,19.68 | DCDC301.10 46.65,12.99 v47.31,13.65
  Route15 0.406: v47.31,13.65 47.31,14.29 46.04,15.56 46.04,17.46 v43.81,19.68
N$14
  Top 0.305: T101.B 52.83,28.57 R103.1
N$15
  Top 0.254: U202.62 17.09,82.28 14.13,85.25 | 14.13,85.25 11.43,87.95 11.43,88.27 10.37,87.2 Q201.2 | C216.1 13.96,85.08 14.13,85.25
N$16
  Top 0.254: U202.61 17.59,82.42 16.83,83.19 16.83,87.82 C217.1 16.91,88.03 16.83,87.95 16.83,93.9 Q201.1
N$18  (via drill 0.3)
  Top 0.254: U202.6 16.17,77.13 v16.83,77.79
  Top 0.305: v11.43,79.06 11.11,79.38 10.16,79.38 8.26,78.42 R212.1 C218.1 R213.2
  Bottom 0.254: v16.83,77.79 16.83,78.11 16.51,78.42 15.24,78.42 14.61,77.79 12.7,77.79 v11.43,79.06
N$19
  Top 0.61: LED102.A 6.54,20.55 R120.1
N$20
  Top 0.305: IC302.7 33.97,34.3 C305.2
N$22
  Top 0.305: LED101.K 9.62,29.27 R107.1
N$23  (via drill 0.3)
  Top 0.305: 72.07,18.37 R301.1
  Top 2.54: X301.4 72.65,18.11 72.07,18.37
  Bottom 0.406: v73.34,17.46 73.34,18.11 73.67,18.11 v74.3,18.73 74.3,18.1 v74.93,17.46
  Bottom 2.54: X301.4 73.34,18.11 72.72,18.11 72.71,18.1
N$24  (via drill 0.3)
  Top 0.61: 72.07,25.35 R302.2
  Top 2.54: X301.1 72.33,25.61 72.07,25.35
  Bottom 0.406: v73.98,24.77 73.13,25.61 72.92,25.61 v73.66,26.35 v74.93,26.35
  Bottom 2.54: X301.1 72.92,25.61 72.81,25.61
N$25  (via drill 0.3)
  Top 0.406: DCDC301.1 46.45,10.7 v46.67,10.48 | R309.2 v50.8,3.81 R310.1
  Bottom 0.406: v46.67,10.48 48.58,10.48 50.8,8.26 v50.8,3.81
N$45
  Top 0.254: U202.20 17.59,68.19 R211.2
N$59
  Top 0.6: R308.1 R307.2
N$68  (via drill 0.3)
  Top 0.305: 32.38,66.04 32.38,66.67 33.97,68.26 IC203.6 | v13.02,18.41 13.02,14.29 11.75,13.02 | 11.75,10.79 X203.2 | v36.2,53.98 v32.07,53.98
  Top 0.61: 11.75,10.79 11.75,13.02
  Top 0.813: X202.1 32.38,66.04
  Bottom 0.305: v32.07,53.98 32.07,53.34 32.38,53.02 32.38,37.78 21.59,26.99 20.95,26.99 15.24,21.27 15.24,20.64 v13.02,18.41 | v36.2,53.98 36.2,54.61 34.61,56.2 34.61,62.55 33.02,64.14
  Bottom 0.61: X202.1 32.38,64.77 33.02,64.14
N$69
  Top 0.185: U202.1 13.99,79.67 13.97,79.69
  Top 0.305: C212.2 13.46,80.2 13.97,79.69
  Top 0.406: L202.2 12.48,80.58 C212.2
N$72
  Top 0.254: 72.87,98.91 70.64,98.91 70.64,96.69 72.87,96.69 | 72.87,98.91 75.09,98.91 | 75.09,98.91 77.31,98.91 | 77.31,98.91 79.53,98.91 79.53,96.69 77.31,96.69 | 77.31,96.69 75.09,96.69 | 75.09,96.69 72.87,96.69 | 72.87,98.91 72.87,96.69 | 75.09,98.91 75.09,96.69 | 77.31,98.91 77.31,96.69
N$73
  Route2 0.254: 72.87,98.9 70.64,98.9 70.64,96.68 72.87,96.68 | 72.87,98.9 75.09,98.9 | 75.09,98.9 77.31,98.9 | 77.31,98.9 79.53,98.9 79.53,96.68 77.31,96.68 | 77.31,96.68 75.09,96.68 | 75.09,96.68 72.87,96.68 | 72.87,98.9 72.87,96.68 | 75.09,98.9 75.09,96.68 | 77.31,98.9 77.31,96.68
N$91
  Top 0.406: IC301.7 37.46,34.3 C304.2
N$98
  Bottom 0.254: 72.87,98.91 70.64,98.91 70.64,96.69 72.87,96.69 | 72.87,98.91 75.09,98.91 | 75.09,98.91 77.31,98.91 | 77.31,98.91 79.53,98.91 79.53,96.69 77.31,96.69 | 77.31,96.69 75.09,96.69 | 75.09,96.69 72.87,96.69 | 72.87,98.91 72.87,96.69 | 75.09,98.91 75.09,96.69 | 77.31,98.91 77.31,96.69
N$102
  Route15 0.254: 72.87,98.9 70.64,98.9 70.64,96.68 72.87,96.68 | 72.87,98.9 75.09,98.9 | 75.09,98.9 77.31,98.9 | 77.31,98.9 79.53,98.9 79.53,96.68 77.31,96.68 | 77.31,96.68 75.09,96.68 | 75.09,96.68 72.87,96.68 | 72.87,98.9 72.87,96.68 | 75.09,98.9 75.09,96.68 | 77.31,98.9 77.31,96.68
NGFF_USB_VBUS  (via drill 0.3)
  Top 0.305: v60.96,26.35 66.36,31.75 82.23,31.75 84.9,34.42 X102.1 | R120.2 v20.32,23.5
  Bottom 0.305: v60.96,26.35 56.2,21.59 30.48,21.59 28.57,23.5 v20.32,23.5
PCM_CLK
  Top 0.305: NGFF101.20 62.79,46.28 71.44,54.93 77.15,54.93 79.38,52.7 83.82,52.7 84.93,53.81 84.93,54.45
  Top 0.813: X101.1 84.93,54.45
PCM_DIN
  Top 0.305: NGFF101.22 62.29,47.05 70.8,55.56 79.38,55.56 81.28,53.66 82.87,53.66 83.66,54.45 83.66,56.99 | X101.3 84.79,58.12
  Top 0.813: 84.79,58.12 83.66,56.99
PCM_DOUT
  Top 0.305: NGFF101.24 61.79,47.82 70.48,56.52 81.28,56.52 | X101.2 82.22,55.58
  Top 0.813: 82.22,55.58 81.28,56.52
PCM_SYNC
  Top 0.305: NGFF101.28 60.79,49.05 69.85,58.1 80.96,58.1
  Top 0.406: 82.38,58.1 X101.4
  Top 0.813: 80.96,58.1 82.38,58.1
PERST  (via drill 0.3)
  Top 0.254: U202.25 20.09,70.64 20.09,72.61 v20,72.71
  Top 0.305: R104.2 49.09,27.75 v42.55,34.29
  Top 0.406: R102.1 R104.2
  Bottom 0.305: v42.55,34.29 37.47,34.29 35.56,36.2 35.56,52.7 33.02,55.24 33.02,60.64 31.75,61.91 29.84,61.91 22.86,68.9 22.54,68.9 20,71.44 v20,72.71
PWR_ON  (via drill 0.3)
  Top 0.305: v66.04,47.94 66.29,47.69 NGFF101.6 66.29,43.43 v66.04,43.18 | v66.04,59.33 66.04,64.1 74.45,72.52 R111.2 76.17,76.23 R112.2 | T101.C 57.93,27.74 C101.1 59.6,27.78 61.12,27.78 v61.28,27.94
  Bottom 0.305: v66.04,47.94 v66.04,59.33 | v61.28,27.94 61.28,33.66 63.82,36.2 63.82,40.96 v66.04,43.18
SENSE  (via drill 0.3)
  Top 0.6: 48.39,20.64 R306.1
  Top 0.61: R306.1 v46.48,20.64 44.13,22.99 44.13,26.99 43.18,27.94 SH301.2
  Top 0.813: DCDC301.5 34.2,10.7 v33.78,11.12
  Bottom 0.61: v33.78,11.12 33.78,18.54 35.88,20.64 v46.48,20.64
SIMTRACE12_USB_D_N
  Top 0.185: R206.1 arc-43 25.08,87.95 26.68,87.95 arc-45 26.99,88.08 | 26.99,88.08 67.31,88.08 arc-45 67.72,87.91 72.57,83.05 arc45 73.25,82.77 73.98,82.77 74.15,82.6 arc45 L201.4 | C202.1 26.88,88.03 arc-45 26.99,88.08
SIMTRACE12_USB_D_P
  Top 0.185: R207.1 arc93 25.24,88.74 26.67,88.74 | 26.67,88.74 26.76,88.74 26.86,88.64 arc45 27.3,88.45 67.31,88.45 arc-45 67.99,88.17 72.84,83.32 arc45 73.25,83.15 73.98,83.15 74.15,83.33 arc-45 L201.1 | C202.2 26.67,88.74
SIMTRACE_LED_GREEN  (via drill 0.3)
  Top 0.254: U202.10 15.52,75.13
  Top 0.305: 15.52,75.13 v15.72,74.93 | LED201.K 15.67,31 v15.56,31.11
  Bottom 0.305: v15.72,74.93 15.72,74.45 15.24,73.98 15.24,70.48 14.61,69.85 14.29,68.9 14.29,67.63 11.75,65.09 10.48,65.09 8.57,63.18 8.57,56.83 5.08,53.34 5.08,35.88 8.89,32.07 14.61,32.07 v15.56,31.11
SIMTRACE_LED_RED  (via drill 0.3)
  Top 0.254: U202.9 16.42,75.63
  Top 0.305: 16.42,75.63 16.67,75.88 v16.99,76.52 | LED202.C v29.85,91.76 v29.84,91.76
  Bottom 0.305: v16.99,76.52 17.14,76.52 17.78,77.15 17.78,78.11 16.83,79.06 16.83,86.04 22.54,91.76 v29.84,91.76
SLOT_CLK  (via drill 0.3)
  Top 0.305: SIM101.C3 26.41,45.98 v26.67,45.72 D101.5 | v26.35,56.2 26.35,59.37 v24.77,60.33 24.74,60.35 IC201.4 | IC202.13 18.7,57.75 19.53,58.58 19.53,60.48 v19.68,60.64 | C103.1 25.75,52.58 v25.72,52.55
  Bottom 0.305: v26.67,45.72 26.67,51.75 v25.72,52.55 25.72,55.56 v26.35,56.2 | v24.77,60.33 21.27,60.33 20.95,60.64 v19.68,60.64
SLOT_DET  (via drill 0.3)
  Top 0.254: U202.31 23.09,68.98
  Top 0.305: SIM101.CD1 28.03,48.52 28.91,49.4 R114.2 | 23.09,68.98 23.09,66.91 v22.23,66.04 | IC201.8 22.58,57.75 v22.54,57.78
  Top 0.406: SIM101.CD1 21.03,48.52 v20.97,48.58
  Bottom 0.305: v20.97,48.58 21.91,49.53 21.91,57.15 v22.54,57.78 22.23,58.1 18.41,58.1 17.78,58.74 17.78,62.87 20.95,66.04 v22.23,66.04
SLOT_IO  (via drill 0.3)
  Top 0.305: SIM101.C7 27.36,47.25 v27.62,46.99 | IC202.11 20.64,56.45 | 20.64,56.45 21.34,56.45 22.54,55.24 v27.3,55.24 26.99,57.15 26.99,60.64 25.98,61.65 IC201.2 | C105.1 20.81,56.28 20.64,56.45 | R105.2 28.42,47.78 v27.62,46.99 | D101.4 27.66,46.95 v27.62,46.99
  Bottom 0.305: v27.62,46.99 27.62,54.93 v27.3,55.24
SLOT_VDD
  Top 0.305: SIM101.C1 27.6,40.9 C106.1 29.24,41.94 31.11,43.81 31.11,46.04 | R105.1 30.45,46.7 31.11,46.04 | D101.3 30.7,46.26 31.11,46.04
  Top 0.406: SIM101.C1 23,40.96 20.95,40.96 TP2.TP 4.76,62.52 IC205.5 3.49,63.5 2.54,63.82 2.54,73.06 IC204.5
ST_DRXD
  Top 0.305: R214.1 36.02,72.34 IC203.4 35.88,70.17 34.73,71.31 R210.2
ST_DTXD  (via drill 0.3)
  Top 0.254: U202.29 22.09,72.1 v22.54,72.55 | IC203.3 38.27,70.97 v38.42,71.12
  Top 0.305: IC203.3 39.56,70.17 C219.1
  Bottom 0.254: v22.54,72.55 23.34,72.55 24.77,71.12 v38.42,71.12
ST_TCK  (via drill 0.3)
  Top 0.254: U202.53 21.59,80.48
  Top 0.305: 21.59,80.48 v21.75,80.33 | TC201.1 33.43,82.33 v33.02,81.92
  Bottom 0.305: v33.02,81.92 32.7,81.6 23.02,81.6 v21.75,80.33
ST_TDI  (via drill 0.3)
  Top 0.254: TC201.9 33.69,77.25 32.26,76.14 | U202.33 26.29,72.13 v26.67,71.75
  Top 0.305: v31.62,75.88 32,75.88 32.26,76.14
  Bottom 0.254: v26.67,71.75 30.8,71.75 31.62,72.58 v31.62,75.88
ST_TDO
  Top 0.254: U202.49 32.03,81.63 32.61,81.06 TC201.3
ST_TMS
  Top 0.254: U202.51 22.59,81.07 22.7,80.64 23.97,80.64 24.29,80.96 31.75,80.96 32.92,79.79 TC201.5
ST_UART1_CLK  (via drill 0.3)
  Top 0.254: U202.41 24.54,76.13 | 15.32,72.63 U202.15 13.26,72.63 9.21,68.58
  Top 0.305: 24.54,76.13 v24.29,75.88 | v16.04,73.34 15.32,72.63 | IC202.7 10.5,58.4 9.21,59.69 9.21,68.58
  Route15 0.305: v16.04,73.34 16.04,74.14 17.78,75.88 19.05,75.88 19.37,76.2 23.97,76.2 v24.29,75.88
ST_UART1_IO  (via drill 0.3)
  Top 0.254: U202.11 14.9,74.63 14.92,74.61 15.08,73.98 | 15.08,73.34 14.87,73.13 U202.14 9.53,73.13 | v24.29,74.61 24.77,74.13 U202.37
  Top 0.305: 15.08,73.34 15.08,73.98 15.56,73.98 16.51,74.3 v22.07,74.3 | IC202.9 10.21,57.1 8.26,59.05 8.26,71.86 9.53,73.13
  Bottom 0.305: v22.07,74.3 22.35,74.61 v24.29,74.61
ST_UART2_CLK
  Top 0.254: U202.44 24.29,77.63 23.5,76.83 23.5,73.98 23.84,73.63 U202.36 27.65,73.63 28.57,72.71 28.57,70.17 22.54,64.14
  Top 0.305: IC201.7 22.88,58.4 22.23,59.05 22.23,63.82 22.54,64.14
ST_UART2_IO  (via drill 0.3)
  Top 0.254: U202.35 U202.34 27.38,72.63 | U202.47 26.43,79.13 v26.67,79.38
  Top 0.305: IC201.9 22.28,57.1 21.27,58.1 21.27,61.12 21.59,61.44 21.59,64.14 27.62,70.17 v27.62,72.39 27.38,72.63
  Bottom 0.254: v26.67,79.38 26.67,73.34 v27.62,72.39
ST_USB_VBUS
  Top 0.6: X201.1 81.9,82 80.33,80.42 79.38,80.42 78.9,80.9 U201.5
TRIM  (via drill 0.3)
  Top 0.406: DCDC301.6 35.52,16.67 v36.01,17.15 | R307.1 54.29,20.29 54.29,19.68 53.34,18.74 43.18,18.73 42.7,19.21 v42.04,19.21
  Top 0.6: R307.1 C312.1
  Bottom 0.406: v42.04,19.21 37.95,19.21 36.01,17.27 v36.01,17.15
UART_TX0  (via drill 0.3)
  Top 0.305: IC203.1 38.32,67.53 37.78,66.99 35.56,66.99 34.92,66.36 34.92,66.04 | 4.76,17.46 4.45,17.14 X203.3 | v33.66,47.31 34.92,48.58 v37.78,48.58 | 6.99,17.46 v12.06,17.46
  Top 0.61: 4.76,17.46 6.99,17.46
  Top 0.813: 34.92,66.04 X202.2
  Bottom 0.305: v33.66,47.31 33.02,46.67 33.02,37.47 21.91,26.35 21.27,26.35 15.88,20.95 15.88,20.32 13.02,17.46 v12.06,17.46 | v37.78,48.58 37.78,54.29 35.24,56.83 35.24,63.18
  Bottom 0.61: X202.2 35.24,64.33 35.24,63.18
USB3.0_RX_N
  Top 0.185: 59.04,37.82 59.04,37.79 arc-45 58.93,38.07 58.93,38.79 arc-45 59.28,39.65 60.46,40.82 arc-45 61.09,41.09 73.66,41.09 arc-90 73.9,40.85 arc90 74.14,40.61 74.16,40.61 arc90 74.4,40.85 arc-90 74.64,41.09 78.91,41.09 arc-45 79.22,40.96 arc45 79.36,40.9 D102.9 | D102.9 | D102.9 80.82,40.9 arc45 81.41,41.14 83.37,43.09 arc-45 83.5,43.15 85.38,43.15 arc-45 X102.9
  Top 0.305: NGFF101.35 59.04,37.79
USB3.0_RX_P
  Top 0.185: 58.54,37.79 58.54,38.09 arc-45 58.55,38.1 58.55,38.79 arc-45 59.01,39.91 60.19,41.09 arc-45 61.09,41.47 79.49,41.47 arc-45 D102.8 81.11,41.4 arc45 81.15,41.41 83.1,43.36 arc-45 83.5,43.53 85.11,43.53 arc45 X102.10
  Top 0.305: NGFF101.37 58.54,37.79
USB3.0_TX_N
  Top 0.185: NGFF101.29 arc-45 60.52,37.25 60.52,38.42 arc-45 60.68,38.83 61.41,39.55 arc-45 62.04,39.81 63.5,39.81 arc-90 63.74,39.58 63.74,39.49 arc90 63.98,39.25 64.1,39.25 arc90 64.34,39.49 64.34,39.58 arc-90 64.58,39.81 69.56,39.81 arc-45 69.92,39.66 69.95,39.63 arc45 70.4,39.45 79.53,39.45 arc-45 D102.12 81.67,39.4 arc45 82.05,39.55 83.55,41.06 arc-45 84,41.24 85.27,41.24 arc-45 X102.6
USB3.0_TX_P
  Top 0.185: NGFF101.31 60.04,37.78 | 60.04,37.78 60.04,37.88 | D102.11 arc-45 79.61,39.88 81.65,39.88 arc45 81.97,40.01 83.4,41.44 arc-45 83.85,41.62 85.21,41.62 arc45 X102.7 | 60.04,37.78 arc45 60.13,38 60.13,38.42 arc-45 60.41,39.09 61.14,39.82 arc-45 62.04,40.2 69.72,40.2 arc-45 70.08,40.05 70.14,39.98 arc45 70.51,39.83 79.49,39.83 arc45 D102.11 | 79.51,39.82 D102.11
V_MODEM  (via drill 0.3)
  Top 0.305: U301.3 82.15,47.23 81.92,46.99 80.85,46.99 | v21.27,28.57 25.5,32.81 IC302.8 | LED101.A 6.57,28.99 v6.35,29.21
  Top 0.406: 80.85,46.37 C308.2 | R111.1 73.37,77.76 v73.34,77.79
  Top 0.5: U301.1 80.85,46.99
  Top 0.61: 80.85,46.99 80.85,46.37
  Route15 0.305: v72.71,60.01 72.71,53.66 73.98,52.39
  Route15 3.81: v40.86,38.96 40.86,48.8 44.45,52.39 73.98,52.39 78.42,47.94 78.42,45.58 v78.64,45.35
  Bottom 0.305: v21.27,28.57 6.99,28.57 v6.35,29.21 | v73.34,77.79 73.03,77.79 72.71,77.47 v72.71,60.01
  other vias: 39.91,39.91 39.59,38.96 79.92,45.35 79.6,47.58 41.5,39.91 77.38,45.35
  pour Top (isolate 0.305): 50.3,43.72 41.34,43.72 41.5,45.47 50.3,45.47
  pour Top (isolate 0.305, no thermals): 81.25,44.88 67.94,44.77 67.42,44.25 66.74,44.25 66.74,46.94 73.66,46.99 74.61,47.94 79.69,47.94 80.64,46.99 81.28,46.99
  pour Top (no thermals): 32.2,36.83 32.2,32.23 40.45,32.23 40.45,36.83
  pour Top: 38.96,45.47 42.13,45.47 41.59,44.77 41.59,41.27 42.23,40.64 42.23,38.73 40.23,36.73 37.37,36.73 37.37,38.01 39.05,39.69
VCC_1V8  (via drill 0.3)
  Top 0.305: R108.2 R109.2 53.26,31.83 v53.02,32.07 52.78,31.83 R106.2 R113.1 | IC202.2 12.49,61.65 13.02,61.28 13.97,61.28 v14.92,60.33
  Top 0.406: 80.85,51.26 C311.2 | v80.64,51.75 80.64,51.34 80.74,51.34 | R115.2 77.85,68.26 R110.2 77.82,66.64 v79.06,65.41 73.98,65.41 64.45,55.88 v54.61,55.88 | v40.01,53.98 38.1,53.98 37.31,53.18 28.73,53.18 28.57,53.34 v14.92,53.34
  Top 0.5: U301.5 80.85,51.26
  Top 0.61: C311.2 80.74,51.34 | v80.64,51.75 v79.69,51.75
  Bottom 0.305: 72.07,51.75 64.14,43.5 56.83,43.5 53.02,39.69 v53.02,32.07
  Bottom 0.406: 72.07,51.75 v79.69,51.75 v80.64,51.75 80.64,61.91 80.96,62.23 | 84.93,62.39 84.93,62.98 84.77,63.13 84.45,63.5 82.23,63.5 80.96,62.23 | 80.96,62.23 v79.06,65.41 | v54.61,55.88 41.91,55.88 v40.01,53.98 | v14.92,53.34 v14.92,60.33
  Bottom 0.813: X101.5 84.93,62.39
VCC_3V3  (via drill 0.3)
  Top 0.254: U202.45 26.93,78.13
  Top 0.305: C204.2 13.19,76.63 U202.7 14.88,76.63 v15.88,76.36 | 26.93,78.13 C213.2 27.02,78.04 | U202.18 16.59,68.63 C214.2 16.19,68.55 v16.19,67.94 | U202.58 19.09,83.49 arc90 C215.2 | C203.2 arc-90 18.83,84.87 v18.83,85.57 | R209.2 28.16,79.75 v27.46,79.06 | IC201.20 31.18,62.3 C207.2 31.27,63.02 v31.27,63.34 | IC202.20 19.53,62.3 C206.2 19.62,62.93 v19.37,63.18 | R214.2 v39.05,72.39 | LED301.A 12.48,22.32 12.86,22.7 29.69,22.7 29.84,22.54 | 29.84,25.08 29.84,22.54 | 29.84,22.54 29.84,21.4 | R201.2 14.36,30.72 v14.61,30.48 | R204.1 3.49,58.42 v3.17,58.1 | R203.1 35.05,91 v35.24,90.81 | R221.1 v33.02,74.61 | R220.1 13.78,69.72 v13.65,69.85 | R311.2 45.4,49.85 v45.72,49.53
  Top 0.406: 26.93,78.13 27.15,78.23 v27.46,79.06 | TC201.4 v36.07,80.42 | v11.37,83.82 L202.1 10.03,82.61 R218.1 | C203.2 C215.2 | v6.35,72.07 6.35,72.52 IC204.1 | R217.2 4,68.14 v4.45,68.58 4,69.03 R215.1
  Top 0.61: IC203.5 v34.92,69.22
  other vias: 30.93,18.73 32.51,19.68 30.29,20.32 32.51,17.78 30.61,16.83 30.29,23.81 32.2,23.18 30.61,6.03 29.97,3.81 31.88,3.81 32.83,6.03
  pour Route15: 2.54,14.29 14.29,2.54 73.82,2.54 87.16,15.88 87.16,84.45 74.3,96.84 14.92,96.84 2.22,84.14
  pour Top (isolate 0.254, no thermals): 36.16,2.54 28.07,2.54 28.07,19.05 29.53,19.05 29.53,26.35 33.02,29.84 35.56,29.84 36.2,29.21 40.01,29.21 40.01,25.4 33.15,25.4 33.15,11.75 36.16,9.21
VDD_1V8_SIMTRACE12  (via drill 0.3)
  Top 0.254: U202.8 12.92,76.13 | U202.12 12.9,74.13 | C210.2 19.59,69.66 U202.24 19.59,71.37 | C211.2 21.27,82.87 21.09,82.69 U202.54 21.09,78.25 20,77.15 19.53,77.15
  Top 0.305: C208.2 15.4,81.92 15.81,81.92 U202.64 | 12.92,76.13 C205.2 | 12.9,74.13 C209.2 | v19.21,71.75 19.59,71.37
  Top 0.406: 15.4,81.92 v15.4,81.28 19.53,77.15 v19.53,75.25 | C205.2 12.86,75.69 v12.86,74.93 12.73,74.8 C209.2
  Route15 0.305: v15.4,81.28 15.4,81.12 12.86,78.58 v12.86,74.93 | v19.21,71.75 19.21,74.93 v19.53,75.25
VERSION_DETECT  (via drill 0.3)
  Top 0.254: U202.13 10.12,73.63 v9.14,74.61
  Top 0.305: R219.2 R218.2 9.84,80.77 9.53,80.01 9.21,79.69 v9.14,79.69
  Bottom 0.305: v9.14,74.61 v9.14,79.69
WWAN  (via drill 0.3)
  Top 0.305: R211.1 15.05,66.23 v14.86,66.2 | v50.48,47.31 50.16,47.62 36.51,47.62 33.97,45.09 33.97,42.55 26.04,34.61 11.11,34.61 v9.53,33.02 9.46,32.96 R107.2 | NGFF101.10 65.29,45.51 v64.45,46.35
  Bottom 0.305: v14.86,66.2 14.13,66.2 12.06,64.14 10.48,64.14 9.21,62.87 9.21,56.52 5.71,53.02 5.71,36.83 v9.53,33.02 | v64.45,46.35 62.23,44.13 53.66,44.13 v50.48,47.31

## Text on the board
Top: 1 | NGFF-cardem | (C) 2021 sysmocom GmbH
Route2: 2
Route15: 3
Bottom: NGFF-cardem | 4 | (C) 2021 sysmocom GmbH
tNames: NGFF-cardem | (C) 2021 sysmocom GmbH | !W_DIS | !GPS_DIS | !RESET | USB3.0 | 5V | DC IN | 12V
bNames: NGFF-cardem | (C) 2021 sysmocom GmbH